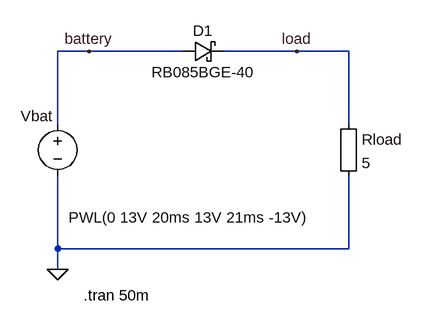
[diagram p0: schematic Reverse battery protection - diode.asc]
Reverse battery protection - diode.asc, the LTspice schematic file:
Version 4
SHEET 1 880 680
WIRE 0 240 -48 240
WIRE 144 240 0 240
WIRE 320 240 208 240
WIRE 400 240 320 240
WIRE -48 352 -48 240
WIRE 400 352 400 240
WIRE -48 544 -48 432
WIRE 400 544 400 432
WIRE 400 544 -48 544
WIRE -48 576 -48 544
FLAG -48 576 0
FLAG 0 240 battery
FLAG 320 240 load
SYMBOL voltage -48 336 R0
WINDOW 123 0 0 Left 0
WINDOW 39 24 44 Left 2
WINDOW 3 17 160 Left 2
WINDOW 0 -57 4 Left 2
SYMATTR Value PWL(0 13V 20ms 13V 21ms -13V)
SYMATTR InstName Vbat
SYMBOL Misc\\EuropeanResistor 384 336 R0
SYMATTR InstName Rload
SYMATTR Value 5
SYMBOL schottky 144 256 R270
WINDOW 0 32 32 VTop 2
WINDOW 3 0 32 VBottom 2
SYMATTR InstName D1
SYMATTR Value RB085BGE-40
SYMATTR Description Diode
SYMATTR Type diode
TEXT -8 616 Left 2 !.tran 50m

The netlist it stands for:
* Reverse battery protection - diode.asc
Vbat battery 0 PWL(0 13V 20ms 13V 21ms -13V)
Rload load 0 5
D1 battery load RB085BGE-40
.model D D
.lib standard.dio
.tran 50m
.backanno
.end